# Altium schematic sheet Sheet1.SchDoc
size A; SheetNumber: 1; SheetTotal: 1
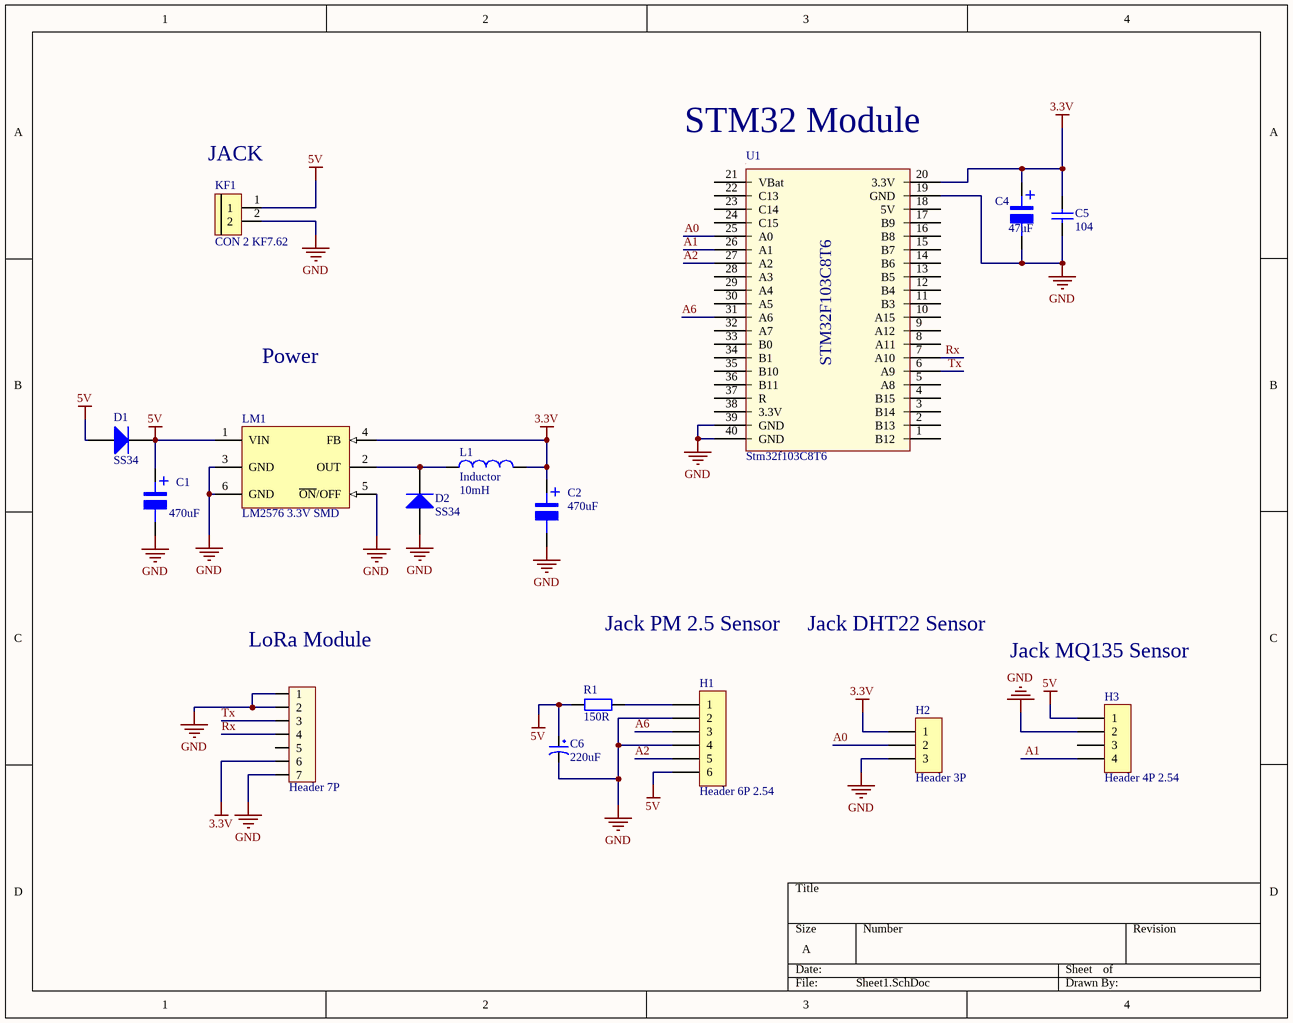
[diagram p0: Sheet1.SchDoc]

## Parts
C1  470uF  [tu nhom 6.3 (d)]
C2  470uF  [tu nhom 6.3 (d)]
C4  47uF  [tu nhom 6.3 (d)]
C5  104  [tu 0805]
C6  220uF  [tu hoa 5mm]
D1  SS34  [DIODE SMA]
D2  SS34  [DIODE SMA]
H1  Header 6P 2.54  [Header 6P DC 2.54]
H2  Header 3P  [Header 3P DC 2.54]
H3  Header 4P 2.54  [Header 4P DC 2.54]
H4  Header 7P  [Header 7P DC 2.54]
KF1  CON 2 KF7.62  [CON 2 KF7.62]
L1  Inductor  value 10mH  [0402-A]
LM1  LM2576 3.3V SMD  [TO263-5]
R1  150R  [tro smd 0805]
U1  Stm32f103C8T6  [PCBComponent_1]

## Nets
3.3V: C2.1 C4.1 C5.2 H2.1 H4.6 L1.2 LM1.4(FB) U1.20(3.3V)
5V: C1.1 C6.1 D1.1(A) D1.2(K) H1.6 H3.1 KF1.1 LM1.1(VIN) R1.1
GND: C1.2 C2.2 C4.2 C5.1 C6.2 D2.1(A) H1.2 H1.4 H2.3 H3.2 H4.1 H4.2 H4.7 KF1.2 LM1.3(GND) LM1.5(~{ON}/OFF) LM1.6(GND) U1.19(GND) U1.39(GND) U1.40(GND)
A0: H2.2 U1.25(A0)
A1: H3.4 U1.26(A1)
A2: H1.5 U1.27(A2)
A6: H1.3 U1.31(A6)
Rx: H4.4 U1.7(A10)
Tx: H4.3 U1.6(A9)
NetD2_2: D2.2(K) L1.1 LM1.2(OUT)
NetH1_1: H1.1 R1.2

Not connected (* = marked no-connect by the designer): H3 3; H4 5; U1 1(B12) 2(B13) 3(B14) 4(B15) 5(A8) 8(A11) 9(A12) 10(A15) 11(B3) 12(B4) 13(B5) 14(B6) 15(B7) 16(B8) 17(B9) 18(5V) 21(VBat) 22(C13) 23(C14) 24(C15) 28(A3) 29(A4) 30(A5) 32(A7) 33(B0) 34(B1) 35(B10) 36(B11) 37(R) 38(3.3V)

## Notes on the sheet
- (near KF1) JACK
- (near U1) STM32 Module
- Power
- Jack PM 2.5 Sensor
- Jack DHT22 Sensor
- (near H4) LoRa Module
- Jack MQ135 Sensor
- (in symbol Stm32F103C8T6) STM32F103C8T6
- (in symbol Tu Nhom 47uF 25V) +

## Library data of the parts
C1 C2 C4 = Tu Nhom 47uF 25V: Dán; Don_Vi: Con; So_Chan: 2; Ten_Linh_Kien: Tụ Nhôm 47uF 25V 6.3x5.5MM; Ma_Hang: MH002216; Chung_Loai: Dán; Kieu_Chan: *
C5 = Tu 0805 104 50V 10%: Dán; Don_Vi: Con; So_Chan: 2; Ten_Linh_Kien: Tụ 0805 104-100nF 10% 50V; Ma_Hang: MH004551; Chung_Loai: Dán; Kieu_Chan: *
C6 = Tu Hoa 220uF 10V 6x11: Cắm; Don_Vi: Con; So_Chan: 2; Ten_Linh_Kien: Tụ Hóa 220uF 10V 6x11MM; Ma_Hang: MH004510; Chung_Loai: Cắm; Kieu_Chan: *
D1 D2 = Diode SS34 ( 1N5822 ): Dán; Don_Vi: Con; Ma_Hang: MH002104; Ten_Linh_Kien: Diode SS34 3A 40V SMA ( 1N5822 SS34A); Kieu_Chan: *; Chung_Loai: Dán
H1 = Header 6P 2.54 Duc Cong: Cắm; Ten_Linh_Kien: Header 6P XH2.54-6P Đực Cong; Don_Vi: Con; Ma_Hang: MH003363; Chung_Loai: Cắm
H2 = Header 3P 2.54 Duc Cong: Cắm; Ten_Linh_Kien: Header 3P XH2.54-3P Đực Cong; Don_Vi: Con; Ma_Hang: MH001302; Chung_Loai: Cắm
H3 = Header 4P 2.54 Duc Cong: Cắm; Ten_Linh_Kien: Header 4P XH2.54-4P Đực Cong; Don_Vi: Con; Ma_Hang: MH001310; Chung_Loai: Cắm
H4 = Header 7P 2.54 Duc Cong: Cắm; Ten_Linh_Kien: Header 7P XH2.54-7P Đực Cong; Don_Vi: Con; Ma_Hang: MH004118; Chung_Loai: Cắm
KF1 = CON 2 KF7.62: Cắm; Ma_Hang: MH002053; Ten_Linh_Kien: CON 2 KF7.62-2P 7.62MM (Đen Thẳng); Chung_Loai: Cắm; Ghi_Chu: *; Kieu_Chan: *; Don_Vi: Con
L1 = Inductor: Code_IEC: 1005; Published: 8-Jun-2000; LatestRevisionDate: 29-May-2009; LatestRevisionNote: IPC-7351 Footprint Added.; PackageReference: 0402-A; Publisher: Altium Limited; PackageDescription: Chip Inductor; Code_JEITA: 0402
LM1 = LM2576 3.3V SMD: Dán; Don_Vi: Con; Ma_Hang: MH001260; Ten_Linh_Kien: LM2576S-3.3V BUCK 3.3V 3A TO263-5; Ghi_Chu: *; Kieu_Chan: *; Chung_Loai: Dán
R1 = Tro 0805 5% 150R: Dán; Don_Vi: Con; So_Chan: 2; Ten_Linh_Kien: Trở 0805 5% 150R; Ma_Hang: MH005255; Chung_Loai: Dán; Kieu_Chan: *